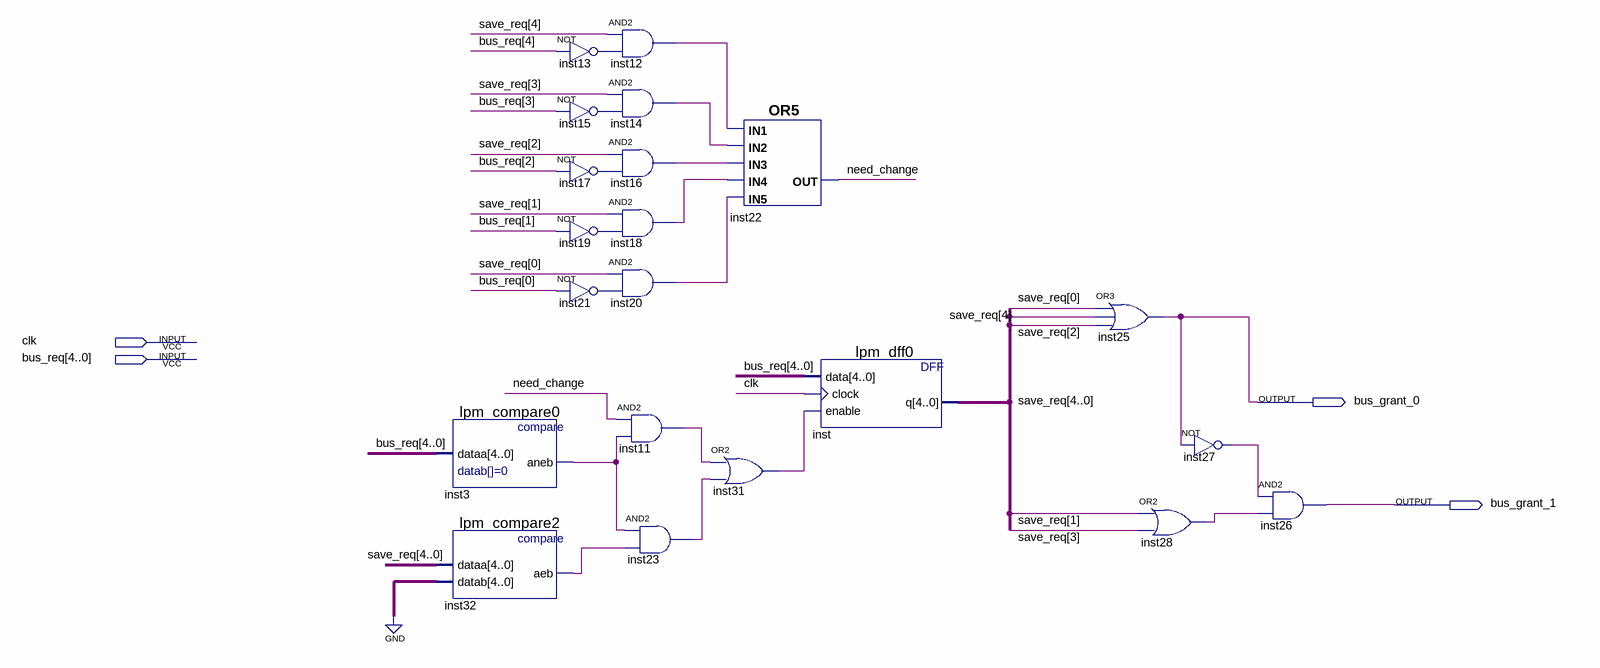
[diagram p0: schematic sheet]
// Quartus schematic Arbitr.bdf as structural Verilog: 21 symbols, 4 pins
module Arbitr (
  input  clk,
  input  [4:0] bus_req,
  output bus_grant_0,
  output bus_grant_1
);

  wire inst3_aneb, inst11_out, inst12_out, inst13_out, inst14_out, inst15_out, inst16_out, inst17_out,
       inst18_out, inst19_out, inst20_out, inst21_out, inst23_out, inst27_out, inst28_out, inst31_out,
       inst32_aeb, need_change;
  wire [4:0] save_req;

  lpm_compare0 inst3 (.dataa(bus_req), .aneb(inst3_aneb));
  lpm_compare2 inst32 (.dataa(save_req), .datab({5{1'b0}}), .aeb(inst32_aeb));
  not inst13 (inst13_out, bus_req[4]);
  not inst15 (inst15_out, bus_req[3]);
  not inst17 (inst17_out, bus_req[2]);
  not inst19 (inst19_out, bus_req[1]);
  not inst21 (inst21_out, bus_req[0]);
  and inst12 (inst12_out, save_req[4], inst13_out);
  and inst14 (inst14_out, save_req[3], inst15_out);
  and inst16 (inst16_out, save_req[2], inst17_out);
  and inst18 (inst18_out, save_req[1], inst19_out);
  and inst20 (inst20_out, save_req[0], inst21_out);
  and inst11 (inst11_out, need_change, inst3_aneb);
  and inst23 (inst23_out, inst3_aneb, inst32_aeb);
  or inst22 (need_change, inst12_out, inst14_out, inst16_out, inst18_out, inst20_out);
  or inst31 (inst31_out, inst11_out, inst23_out);
  lpm_dff0 inst (.data(bus_req), .clock(clk), .enable(inst31_out), .q(save_req));
  or inst25 (bus_grant_0, save_req[0], save_req[4], save_req[2]);
  or inst28 (inst28_out, save_req[1], save_req[3]);
  not inst27 (inst27_out, bus_grant_0);
  and inst26 (bus_grant_1, inst27_out, inst28_out);
endmodule
